# EAGLE design SWARM-OSMC (EAGLE 4.16)
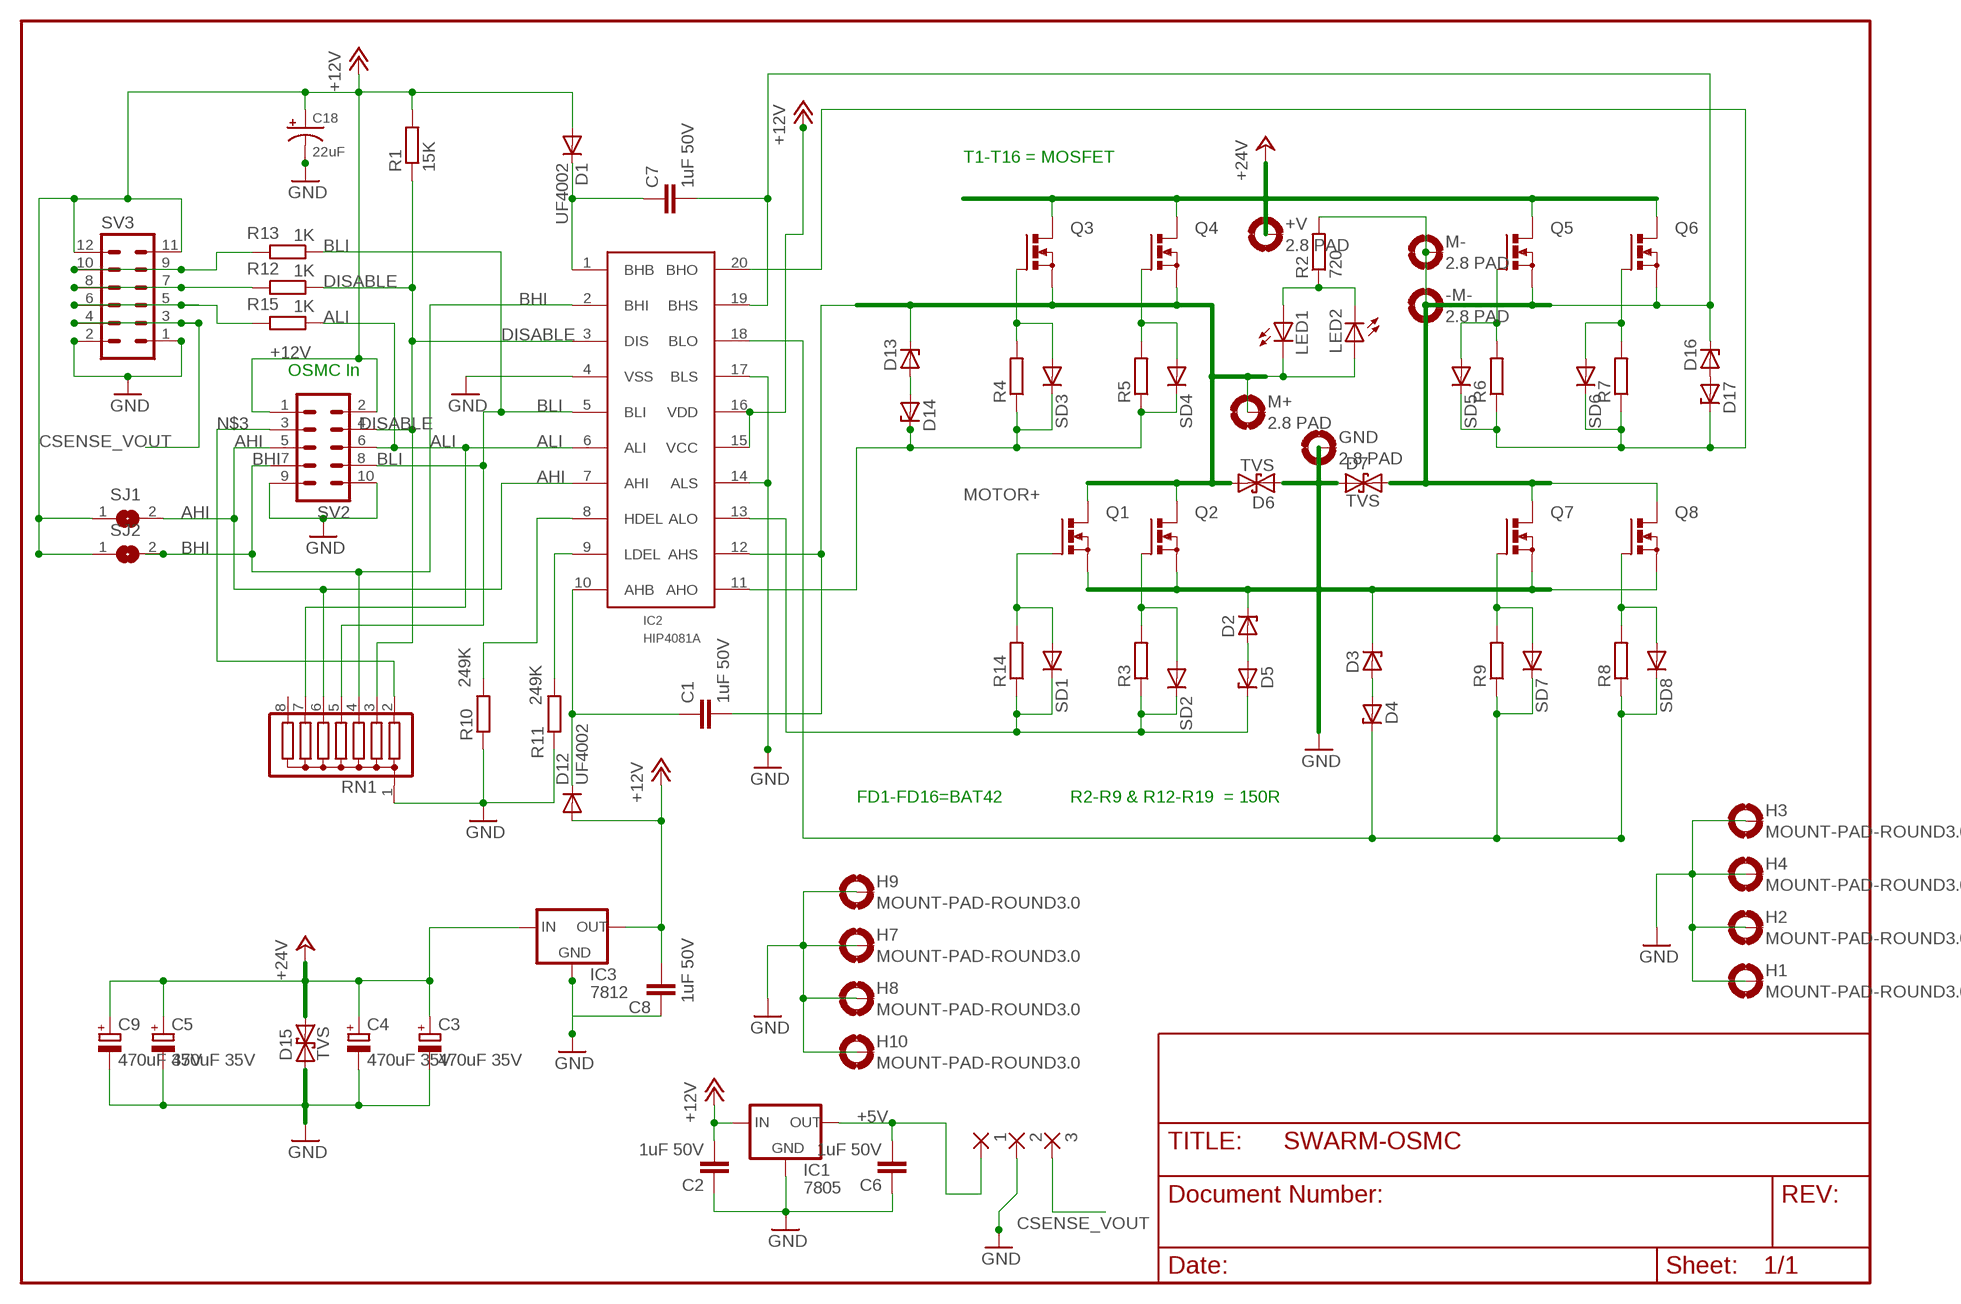
[diagram p0: schematic, sheet 1]

## Parts
1  1,6/0,8  [1,6/0,8]
2  1,6/0,8  [1,6/0,8]
3  1,6/0,8  [1,6/0,8]
+V  2.8 PAD  MOUNT-PAD-ROUND2.8  [2,8-PAD]
-M-  2.8 PAD  MOUNT-PAD-ROUND2.8  [2,8-PAD]
C1  1uF 50V  C-EUC1206  [C1206]
C2  1uF 50V  C-EUC1206  [C1206]
C3  470uF 35V  CPOL-EUE5-10.5  [E5-10,5@1]
C4  470uF 35V  CPOL-EUE5-10.5  [E5-10,5@1]
C5  470uF 35V  CPOL-EUE5-10.5  [E5-10,5@1]
C6  1uF 50V  C-EUC1206  [C1206]
C7  1uF 50V  C-EUC1206  [C1206]
C8  1uF 50V  C-EUC1206  [C1206]
C9  470uF 35V  CPOL-EUE5-10.5  [E5-10,5@1]
C18  22uF  CPOL-USCT7343  [CT7343]
D1  UF4002  DIODE-DO41-10  [DO41-10]
D2  ZENER-DIODESOD80C  [SOD80C]
D3  ZENER-DIODESOD80C  [SOD80C]
D4  ZENER-DIODESOD80C  [SOD80C]
D5  ZENER-DIODESOD80C  [SOD80C]
D6  TVS  P6KEXXC  [CB417-15]
D7  TVS  P6KEXXC  [CB417-15]
D12  UF4002  DIODE-DO41-10  [DO41-10]
D13  ZENER-DIODESOD80C  [SOD80C]
D14  ZENER-DIODESOD80C  [SOD80C]
D15  TVS  P6KEXXC  [CB417-15]
D16  ZENER-DIODESOD80C  [SOD80C]
D17  ZENER-DIODESOD80C  [SOD80C]
GND  2.8 PAD  MOUNT-PAD-ROUND2.8  [2,8-PAD]
H1  MOUNT-PAD-ROUND3.0  [3,0-PAD]
H2  MOUNT-PAD-ROUND3.0  [3,0-PAD]
H3  MOUNT-PAD-ROUND3.0  [3,0-PAD]
H4  MOUNT-PAD-ROUND3.0  [3,0-PAD]
H7  MOUNT-PAD-ROUND3.0  [3,0-PAD]
H8  MOUNT-PAD-ROUND3.0  [3,0-PAD]
H9  MOUNT-PAD-ROUND3.0  [3,0-PAD]
H10  MOUNT-PAD-ROUND3.0  [3,0-PAD]
IC1  7805  78XXS  [78XXS]
IC2  HIP4081A  [DIL20]
IC3  7812  78XXS  [78XXS]
LED1  LEDCHIPLED_1206  [CHIPLED_1206]
LED2  LEDCHIPLED_1206  [CHIPLED_1206]
M+  2.8 PAD  MOUNT-PAD-ROUND2.8  [2,8-PAD]
M-  2.8 PAD  MOUNT-PAD-ROUND2.8  [2,8-PAD]
Q1  PMOSFET_NTO220BV  [TO220BV]
Q2  PMOSFET_NTO220BV  [TO220BV]
Q3  PMOSFET_NTO220BV  [TO220BV]
Q4  PMOSFET_NTO220BV  [TO220BV]
Q5  PMOSFET_NTO220BV  [TO220BV]
Q6  PMOSFET_NTO220BV  [TO220BV]
Q7  PMOSFET_NTO220BV  [TO220BV]
Q8  PMOSFET_NTO220BV  [TO220BV]
R1  15K  R-EU_R1206  [R1206]
R2  720  R-EU_R1206  [R1206]
R3  R-EU_R1206  [R1206]
R4  R-EU_R1206  [R1206]
R5  R-EU_R1206  [R1206]
R6  R-EU_R1206  [R1206]
R7  R-EU_R1206  [R1206]
R8  R-EU_R1206  [R1206]
R9  R-EU_R1206  [R1206]
R10  249K  R-EU_R1206  [R1206]
R11  249K  R-EU_R1206  [R1206]
R12  1K  R-EU_R1206  [R1206]
R13  1K  R-EU_R1206  [R1206]
R14  R-EU_R1206  [R1206]
R15  1K  R-EU_R1206  [R1206]
RN1  G07R  [SIL8]
SD1  DIODE-SOD123  [SOD123]
SD2  DIODE-SOD123  [SOD123]
SD3  DIODE-SOD123  [SOD123]
SD4  DIODE-SOD123  [SOD123]
SD5  DIODE-SOD123  [SOD123]
SD6  DIODE-SOD123  [SOD123]
SD7  DIODE-SOD123  [SOD123]
SD8  DIODE-SOD123  [SOD123]
SJ1  SJ  [SJ]
SJ2  SJ  [SJ]
SV2  MA05-2  [MA05-2]
SV3  MA06-2  [MA06-2]

## Nets
+5V: 1.1(P) C6.2 IC1.OUT
+12V: C2.2 C8.2 C18.+ D1.A D12.A IC1.IN IC2.15(VCC) IC2.16(VDD) IC3.OUT R1.2 SJ1.1 SJ2.1 SV2.1 SV2.2 SV3.11 SV3.12
+24V: +V.B2,8(MOUNT) C3.+ C4.+ C5.+ C9.+ D15.C IC3.IN Q3.D Q4.D Q5.D Q6.D
AHI: IC2.7(AHI) RN1.6 SJ1.2 SV2.5
AHO: D14.C IC2.11(AHO) R4.1 R5.1 SD3.C SD4.C
ALI: IC2.6(ALI) R15.1 RN1.7 SV2.6
ALO: D5.C IC2.13(ALO) R3.1 R14.1 SD1.C SD2.C
BHI: IC2.2(BHI) RN1.4 SJ2.2 SV2.7
BHO: D17.C IC2.20(BHO) R6.1 R7.1 SD5.C SD6.C
BLI: IC2.5(BLI) R13.1 RN1.5 SV2.8
BLO: D4.C IC2.18(BLO) R8.1 R9.1 SD7.C SD8.C
CSENSE_VOUT: 3.1(P) SV3.3 SV3.4
DISABLE: IC2.3(DIS) R1.1 R12.1 RN1.3 SV2.4
GND: 2.1(P) C2.1 C3.- C4.- C5.- C6.1 C8.1 C9.- C18.- D2.C D3.C D6.A D7.A D15.A GND.B2,8(MOUNT) H1.B3,0(MOUNT) H2.B3,0(MOUNT) H3.B3,0(MOUNT) H4.B3,0(MOUNT) H7.B3,0(MOUNT) H8.B3,0(MOUNT) H9.B3,0(MOUNT) H10.B3,0(MOUNT) IC1.GND IC2.4(VSS) IC2.14(ALS) IC2.17(BLS) IC3.GND Q1.S Q2.S Q7.S Q8.S R10.1 R11.1 RN1.1 SV2.9 SV2.10 SV3.1 SV3.2
MOTOR+: C1.2 D6.C D13.C IC2.12(AHS) LED1.C LED2.A M+.B2,8(MOUNT) Q1.D Q2.D Q3.S Q4.S
MOTOR-: -M-.B2,8(MOUNT) C7.2 D7.C D16.C IC2.19(BHS) M-.B2,8(MOUNT) Q5.S Q6.S Q7.D Q8.D R2.2
N$1: C1.1 D12.C IC2.10(AHB)
N$2: C7.1 D1.C IC2.1(BHB)
N$3: RN1.2 SV2.3
N$5: LED1.A LED2.C R2.1
N$6: IC2.8(HDEL) R10.2
N$7: IC2.9(LDEL) R11.2
N$8: Q5.G R6.2 SD5.A
N$12: Q2.G R3.2 SD2.A
N$13: R13.2 SV3.9 SV3.10
N$14: Q3.G R4.2 SD3.A
N$15: R12.2 SV3.7 SV3.8
N$16: Q1.G R14.2 SD1.A
N$17: Q7.G R9.2 SD7.A
N$18: R15.2 SV3.5 SV3.6
N$21: Q8.G R8.2 SD8.A
N$23: D13.A D14.A
N$31: D16.A D17.A
N$32: Q6.G R7.2 SD6.A
N$41: D2.A D5.A
N$44: D3.A D4.A
SD4: Q4.G R5.2 SD4.A
Unconnected: RN1.8

## Notes on the sheet
- T1-T16 = MOSFET
- OSMC In
- FD1-FD16=BAT42 | R2-R9 & R12-R19  = 150R

## Library data of the parts
1-3 = wirepad:1,6/0,8: THROUGH-HOLE PAD
+V -M- GND H1-H4 H7-H10 M+ M- = holes:MOUNT-PAD-ROUND: MOUNTING PAD, round
C1 C2 C6-C8 = rcl:C-EU: CAPACITOR, European symbol
C3-C5 C9 = rcl:CPOL-EU: POLARIZED CAPACITOR, European symbol
C18 = rcl:CPOL-US: POLARIZED CAPACITOR, American symbol
D1 D12 SD1-SD8 = diode:DIODE-: DIODE
D2-D5 D13 D14 D16 D17 = diode:ZENER-DIODE: Z-Diode
D6 D7 D15 = diode:P6KEXXC: DIODE transient-voltage suppressor
IC1 IC3 = v-reg:78XXS: VOLTAGE REGULATOR
IC2 = My linear:HIP4081A: Full Bridge FET driver
LED1 LED2 = led:LED: LED OSRAM: - CHIPLED LG R971, LG N971, LY N971, LG Q971, LY Q971, LO R971, LY R971 LH N974, LH R974 LS Q976, LO Q976, LY Q976 LO Q996 - Hyper CHIPLED LW Q18S LB Q993, LB Q99A, LB R99A - SideLED LS A670, LO A670, LY A670, LG A670, LP A670 LB A673, LV A673, LT A673, LW A673 LH A674 LY A675 LS A676, LA A676, LO A676, LY A676, LW A676 LS A679, LY A679, LG A679 - Hyper Micro SIDELED® LS Y876, LA Y876, LO Y876, LY Y876 LT Y87S - SmartLED LW L88C, LW L88S LB L89C, LB L89S, LG L890 LS L89K, LO L89K, LY L89K LS L896, LA L896, LO L896, LY L896 - TOPLED LS T670, LO T670, LY T670, LG T670, LP T670 LSG T670, LSP T670, LSY T670, LOP T670, LYG T670 LG T671, LOG T671, LSG T671 LB T673, LV T673, LT T673, LW T673 LH T674 LS T676, LA T676, LO T676, LY T676, LB T676, LH T676, LSB T676, LW T676 LB T67C, LV T67C, LT T67C, LS T67K, LO T67K, LY T67K, LW E67C LS E67B, LA E67B, LO E67B, LY E67B, LB E67C, LV E67C, LT E67C LW T67C LS T679, LY T679, LG T679 LS T770, LO T770, LY T770, LG T770, LP T770 LB T773, LV T773, LT T773, LW T773 LH T774 LS E675, LA E675, LY E675, LS T675 LS T776, LA T776, LO T776, LY T776, LB T776 LHGB T686 LT T68C, LB T68C - Hyper Mini TOPLED® LB M676 - Mini TOPLED Santana® LG M470 LS M47K, LO M47K, LY M47K Source: http://www.osram.convergy.de - LUMILED® LXK2-PW12-R00, LXK2-PW12-S00, LXK2-PW14-U00, LXK2-PW14-V00 LXK2-PM12-R00, LXK2-PM12-S00, LXK2-PM14-U00 LXK2-PE12-Q00, LXK2-PE12-R00, LXK2-PE12-S00, LXK2-PE14-T00, LXK2-PE14-U00 LXK2-PB12-K00, LXK2-PB12-L00, LXK2-PB12-M00, LXK2-PB14-N00, LXK2-PB14-P00, LXK2-PB14-Q00 LXK2-PR12-L00, LXK2-PR12-M00, LXK2-PR14-Q00, LXK2-PR14-R00 LXK2-PD12-Q00, LXK2-PD12-R00, LXK2-PD12-S00 LXK2-PH12-R00, LXK2-PH12-S00 LXK2-PL12-P00, LXK2-PL12-Q00, LXK2-PL12-R00 Source: www.luxeon.com
Q1-Q8 = transistor-power:PMOSFET_N: Power MOSFET N-Channel
R1-R15 = rcl:R-EU_: RESISTOR, European symbol
RN1 = resistor-sil:G07R: SIL RESISTOR
SJ1 SJ2 = jumper:SJ: SMD solder JUMPER
SV2 = con-lstb:MA05-2: PIN HEADER
SV3 = con-lstb:MA06-2: PIN HEADER

## Board
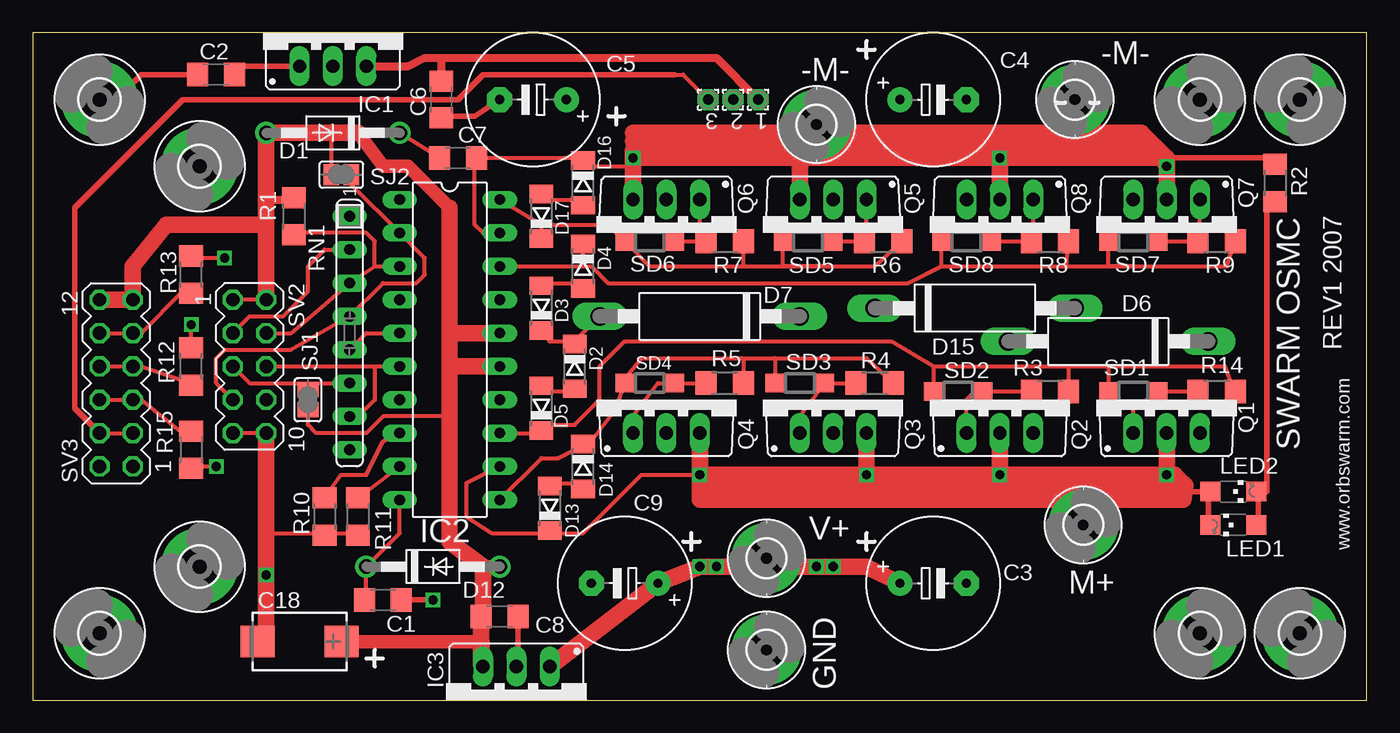
[diagram p1: board, top side]
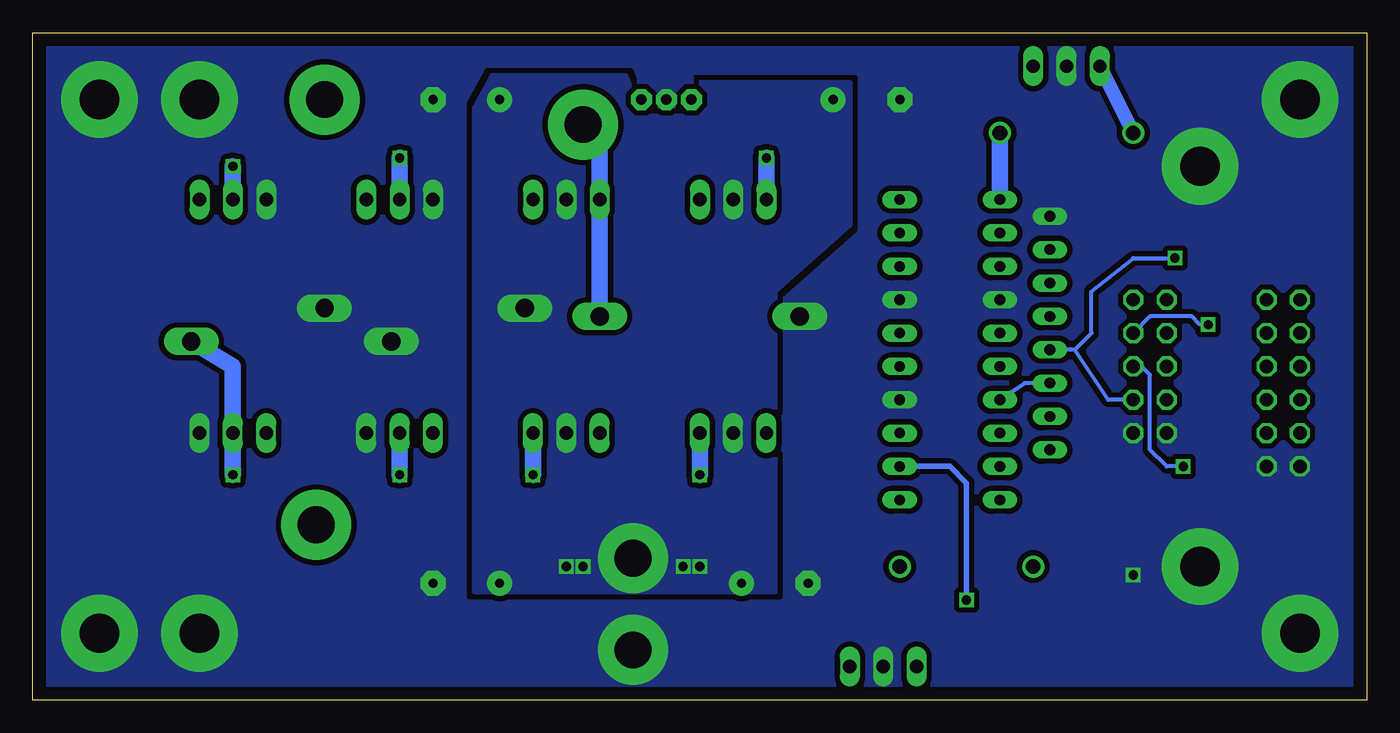
[diagram p2: board, bottom side, seen from below]

Size 101.6 x 50.8 mm. Coordinates in mm from the lower left corner, seen from the top.
Outline: 0,0 101.6,0 101.6,50.8 0,50.8 0,0
Copper layers (1*16): Top 0.035mm / dielectric 1.5mm / Bottom 0.035mm
Design rules "default": minimum track width 10mil, minimum drill 24mil, track to track 8mil, track to pad 8mil, pad to pad 8mil, via to via 8mil, smd to smd 8mil, copper to edge 40mil, drill to drill 8mil, minimum pad ring 10mil, minimum via ring 8mil, stop-mask expansion 4mil, vias tented up to drill 0mil, thermal gap 10mil

### Footprints (pad centres in the part's own frame; a part is rotated, then mirrored left to right if it is on the bottom)
1,6/0,8 = drill 0.813 pad 1.6 octagon: 1 0,0
2,8-PAD = drill 2.8 pad 5.334 round: B2,8 0,0
C1206 = smd 1.6 x 1.8: 1 -1.4,0; 2 1.4,0
E5-10,5@1 = drill 0.7 pad 1.9 round: + -2.54,0 | drill 0.7 pad 1.9 octagon: - 2.54,0
CT7343 = smd 2.6 x 2.4: + 3.2,0; - -3.2,0
DO41-10 = drill 1.118 round: A 5.08,0; C -5.08,0
SOD80C = smd 1.4 x 1.8: A 1.7,0; C -1.7,0
CB417-15 = drill 1.397 long: A 7.62,0; C -7.62,0
3,0-PAD = drill 3 pad 5.842 round: B3,0 0,0
78XXS = drill 1.016 long: GND 0,-2.54; IN -2.54,-2.54; OUT 2.54,-2.54
DIL20 = drill 0.813 long: 1 -11.43,-3.81; 2 -8.89,-3.81; 3 -6.35,-3.81; 4 -3.81,-3.81; 5 -1.27,-3.81; 6 1.27,-3.81; 7 3.81,-3.81; 8 6.35,-3.81; 9 8.89,-3.81; 10 11.43,-3.81; 11 11.43,3.81; 12 8.89,3.81; 13 6.35,3.81; 14 3.81,3.81; 15 1.27,3.81; 16 -1.27,3.81; 17 -3.81,3.81; 18 -6.35,3.81; 19 -8.89,3.81; 20 -11.43,3.81
CHIPLED_1206 = smd 1.5 x 1.5: A 0,-1.75; C 0,1.75
TO220BV = drill 1.016 long: D 0,-2.54; G -2.54,-2.54; S 2.54,-2.54
R1206 = smd 1.6 x 1.803: 1 -1.422,0; 2 1.422,0
SIL8 = drill 0.813 long: 1 -8.89,0; 2 -6.35,0; 3 -3.81,0; 4 -1.27,0; 5 1.27,0; 6 3.81,0; 7 6.35,0; 8 8.89,0
SOD123 = smd 1.4 x 1.4: A 1.9,0; C -1.9,0
SJ = smd 1.168 x 1.6: 1 -0.762,0; 2 0.762,0
MA05-2 = drill 1.016 octagon: 1 -5.08,-1.27; 2 -5.08,1.27; 3 -2.54,-1.27; 4 -2.54,1.27; 5 0,-1.27; 6 0,1.27; 7 2.54,-1.27; 8 2.54,1.27; 9 5.08,-1.27; 10 5.08,1.27
MA06-2 = drill 1.016 octagon: 1 -6.35,-1.27; 2 -6.35,1.27; 3 -3.81,-1.27; 4 -3.81,1.27; 5 -1.27,-1.27; 6 -1.27,1.27; 7 1.27,-1.27; 8 1.27,1.27; 9 3.81,-1.27; 10 3.81,1.27; 11 6.35,-1.27; 12 6.35,1.27

### Placement (x,y rotation side)
1  55.24,45.72 180 top
2  53.34,45.72 180 top
3  51.44,45.72 180 top
+V  55.88,10.79 0 top
-M-  79.38,45.72 0 top
C1  26.67,7.62 0 top
C2  13.97,47.62 0 top
C3  68.58,8.89 0 top
C4  68.58,45.72 0 top
C5  38.1,45.72 180 top
C6  31.11,45.72 90 top
C7  32.38,41.27 0 top
C8  35.56,6.35 180 top
C9  45.09,8.89 180 top
C18  20.32,4.45 0 top
D1  22.86,43.18 180 top
D2  41.27,25.4 270 top
D3  38.73,29.84 90 top
D4  41.91,33.02 270 top
D5  38.73,22.23 90 top
D6  81.92,27.3 180 top
D7  50.8,29.21 180 top
D12  30.48,10.16 0 top
D13  39.37,14.61 90 top
D14  41.91,17.78 270 top
D15  71.75,29.84 0 top
D16  41.91,39.37 270 top
D17  38.73,36.83 90 top
GND  55.88,3.81 0 top
H1  12.7,10.16 0 top
H2  12.7,40.64 0 top
H3  88.9,5.08 0 top
H4  88.9,45.72 0 top
H7  5.08,45.72 90 top
H8  96.52,45.72 90 top
H9  96.52,5.08 90 top
H10  5.08,5.08 90 top
IC1  22.86,50.8 0 top
IC2  31.75,26.67 270 top
IC3  36.83,0 180 top
LED1  91.44,13.34 90 top
LED2  91.44,15.88 270 top
M+  80.01,13.34 0 top
M-  59.69,43.81 0 top
Q1  86.36,22.86 0 top
Q2  73.66,22.86 0 top
Q3  60.96,22.86 0 top
Q4  48.26,22.86 0 top
Q5  60.96,35.56 180 top
Q6  48.26,35.56 180 top
Q7  86.36,35.56 180 top
Q8  73.66,35.56 180 top
R1  19.88,36.83 90 top
R2  94.61,39.37 90 top
R3  77.47,23.5 180 top
R4  64.14,24.13 180 top
R5  52.7,24.13 180 top
R6  64.77,34.92 180 top
R7  52.7,34.92 180 top
R8  77.47,34.92 180 top
R9  90.17,34.92 180 top
R10  22.23,13.97 90 top
R11  24.77,13.97 90 top
R12  12.06,25.4 270 top
R13  12.06,32.38 270 top
R14  90.17,23.5 180 top
R15  12.06,19.05 90 top
RN1  24.13,27.94 270 top
SD1  83.82,23.5 0 top
SD2  70.48,23.5 0 top
SD3  58.42,24.13 0 top
SD4  46.99,24.13 0 top
SD5  59.05,34.92 0 top
SD6  46.99,34.92 0 top
SD7  83.82,34.92 0 top
SD8  71.12,34.92 0 top
SJ1  20.95,22.86 90 top
SJ2  23.5,40.01 0 top
SV2  16.51,25.4 270 top
SV3  6.35,24.13 90 top

### Tracks (layer width: path | path; a pad name or v marks a point on that pad's centre or on a via)
+5V
  Top 0.61: 31.11,48.9 29.84,48.9 28.57,48.26 IC1.OUT | 31.11,48.9 52.07,48.9 1.1 | 31.11,48.9 C6.2
+12V
  Top 0.305: SV2.2 SV2.1 | SJ1.1 20.95,20.95 21.59,20.32 25.4,20.32 26.67,21.59 31.75,21.59 | SJ2.1 22.73,43.69 22.86,43.18
  Top 0.406: C2.2 15.88,47.62 15.88,48.26 IC1.IN
  Top 0.61: 17.78,38.1 19.68,38.1 R1.2
  Top 1.016: 31.75,37.47 28.57,40.64 26.67,40.64 24.77,43.18 | C8.2 34.29,6.35 | 34.16,2.67 IC3.OUT 34.29,4.45 C18.+ | 34.29,10.16 D12.A
  Top 1.27: 31.75,25.4 31.75,27.94 | 31.75,27.94 IC2.16 | 31.75,25.4 IC2.15 | 17.78,36.2 SV2.2 | 31.75,27.94 31.75,37.47 | 24.77,43.18 22.86,43.18 D1.A 17.78,38.1 17.78,36.2 | SV3.12 SV3.11 7.62,33.02 10.16,36.2 17.78,36.2 | 34.29,6.35 34.29,10.16 31.75,12.06 31.75,21.59 31.75,25.4 | 34.16,2.67 C8.2
  Bottom 1.016: D1.A IC1.IN
+24V  (via drill 0.7)
  Top 1.27: IC3.IN C9.+ v50.8,10.16 v52.07,10.16 55.88,10.16 | 55.88,10.16 +V.B2,8 | 55.88,10.16 v59.69,10.16 v60.96,10.16 63.5,10.16 C3.+
  pour Bottom (isolate 0.406, no thermals): 45.09,8.26 58.42,8.26 58.1,8.26 67.94,8.26 67.94,45.09 66.62,47.52 56.46,47.52 55.24,44.45 51.44,44.45 50.8,46.99 39.37,46.99 39.37,36.2 45.09,31.11
AHI
  Top 0.305: 20.95,24.13 16.51,24.13 SV2.5 | 20.95,24.13 RN1.6 | 20.95,24.13 SJ1.2
  Bottom 0.305: IC2.7 26.04,24.13 RN1.6
AHO
  Top 0.305: 53.98,26.04 46.35,26.04 45.09,24.44 SD4.C 44.45,22.23 42.55,19.68 41.91,19.68 | R5.1 54.13,25.88 53.98,26.04 | 56.52,26.04 63.5,26.04 R4.1 | 53.98,26.04 56.52,26.04 | 56.52,26.04 SD3.C | 42.34,19.48 D14.C 41.91,19.68 | 42.34,19.48 41.27,19.05 40.01,18.41 38.73,18.41 IC2.11 | 42.34,19.48 41.91,19.68
ALI  (via drill 0.7)
  Top 0.305: 26.04,25.4 IC2.6 | RN1.7 24.77,21.59 26.04,22.86 26.04,25.4 | SV2.6 26.04,25.4 | v13.97,17.78 12.06,17.78 R15.1 12.06,17.14
  Bottom 0.305: 17.14,25.4 16.51,24.77 16.51,19.05 15.24,17.78 v13.97,17.78
  Bottom 0.406: 17.14,25.4 SV2.6
ALO
  Top 0.305: 68.58,25.39 70.48,25.4 78.89,25.4 | 78.89,25.4 81.92,25.4 | 78.89,25.4 R3.1 | SD1.C 81.92,25.4 | 81.92,25.4 90.81,25.4 91.5,23.33 91.44,23.5 R14.1 | 68.58,25.39 SD2.C | 68.58,25.39 65.41,27.3 45.09,27.3 43.18,25.4 43.18,22.86 41.27,20.95 38.1,20.95 | IC2.13 38.1,20.32 38.1,20.95 | 38.1,20.95 D5.C
BHI
  Top 0.305: SV2.7 13.97,24.13 13.97,26.04 14.61,26.67 19.68,26.67 RN1.4 26.67,31.75 29.21,31.75 29.84,32.38 29.84,33.66 IC2.2 24.26,39.24 SJ2.2
BHO
  Top 0.305: 54.13,33.02 R7.1 | R6.1 64.14,33.02 60.33,33.02 | 54.13,33.02 60.33,33.02 | SD5.C 57.16,33.02 60.33,33.02 | SD6.C 46.99,33.02 54.13,33.02 | 38.73,36.2 43.81,36.2 SD6.C | SD6.C | D17.C 38.73,36.2 | 38.73,36.2 IC2.20
BLI  (via drill 0.7)
  Top 0.305: IC2.5 25.4,27.94 RN1.5 | v14.61,33.66 12.06,33.66 R13.1
  Bottom 0.305: 22.23,26.67 19.68,22.86 SV2.8 | 22.23,26.67 RN1.5 | 22.23,26.67 20.95,27.94 20.95,31.11 17.78,33.66 v14.61,33.66
BLO
  Top 0.305: R9.1 90.96,33.02 83.82,33.02 | SD7.C 81.92,33.02 83.82,33.02 | 78.74,33.02 R8.1 | 78.74,33.02 83.82,33.02 | SD8.C 69.22,33.02 | 69.22,33.02 78.74,33.02 | 69.22,33.02 66.67,31.75 43.81,31.75 42.55,33.02 41.91,33.02 | 41.91,33.02 D4.C | IC2.18 41.91,33.02
CSENSE_VOUT
  Top 0.305: SV3.4 SV3.3 | 48.9,47.62 49.53,47.62 3.1
  Top 0.406: SV3.4 3.17,22.23 3.17,37.47 11.43,45.72 32.38,45.72 34.29,47.62 48.9,47.62
DISABLE  (via drill 0.7)
  Top 0.305: 26.04,33.02 IC2.3 | 26.04,33.02 RN1.3 19.68,27.94 SV2.4 | R1.1 20.17,35.41 20.32,35.56 25.4,35.56 26.04,34.92 26.04,33.02 | R12.1 v12.06,28.57 R12.1 | R12.1 12.06,26.67
  Bottom 0.305: SV2.4 16.51,29.21 13.34,29.21 12.7,28.57 v12.06,28.57
GND  (via drill 0.7)
  Top 0.305: 41.27,27.3 39.37,27.3 D3.C | 41.27,27.3 D2.C | 41.27,27.3 D7.A | 24.77,12.7 22.23,12.7 17.78,12.7 SV2.10 17.75,20.32 | 17.75,20.32 17.14,20.32 | 17.14,20.32 SV2.9 | 17.75,20.32 17.12,20.3 17.14,20.32
  Top 0.406: C8.1 36.96,2.67 IC3.GND | H7.B3,0 6.35,45.72 8.26,47.62 C2.1 12.7,47.62 | C6.1 31.75,44.45 33.66,44.45 C5.-
  Top 1.27: 24.77,12.7 R11.1 | 22.23,12.7 R10.1 | C18.- 17.78,5.08 v17.78,9.53 17.75,20.32
  pour Bottom (isolate 0.406, rank 2, no thermals): 100.97,0.64 100.97,50.16 0.64,50.16 0.64,0.64
MOTOR+  (via drill 0.7)
  Top 0.305: v50.8,17.14 46.35,17.14 41.91,12.7 38.73,12.7 D13.C 38.53,12.7 34.92,12.7 33.02,13.97 33.02,16.51 IC2.12 | 81.43,15.09 87.63,15.24 87,15.88 86.36,16.51 | v86.36,17.14 85.09,15.88
  Top 0.406: Q1.D v86.36,17.14 80.64,17.14 | C1.2 v30.48,7.62 | C1.2 28.57,7.62 | C1.2 27.94,7.62 | LED1.C 89.53,13.34 89.53,15.88 | 87,15.88 89.53,15.88 | 89.53,15.88 LED2.A | 80.01,15.24 M+.B2,8
  Top 1.27: v63.5,17.14 Q3.S | v50.8,17.14 v63.5,17.14 | v73.66,17.14 v86.36,17.14 Q1.D | v63.5,17.14 v73.66,17.14 | v50.8,17.14 50.8,18.41 | 50.8,18.41 Q4.S | v73.66,17.14 Q2.D | v50.8,17.14 v63.5,17.14 | 50.8,18.41 50.8,16.51 | 50.8,16.51 50.8,15.24 80.01,15.24 87.63,15.24 87.78,16.36 87,17.14 | 50.8,16.51 86.36,16.51 87.63,16.51
  Bottom 0.406: IC2.12 31.75,17.78 30.48,16.51 v30.48,7.62
  Bottom 1.27: v63.5,17.14 Q3.S | v50.8,17.14 Q4.S | v73.66,17.14 Q2.D | v86.36,17.14 86.36,25.4 D6.C
MOTOR-  (via drill 0.7)
  Top 0.305: 41.91,40.64 41.91,41.27 C7.2 | 41.91,40.64 45.72,40.64 | 33.66,41.27 33.66,36.2 34.29,35.56 IC2.19 | 41.91,40.64 D16.C | 58.42,41.27 58.42,41.91 59.69,41.91
  Top 0.406: v86.36,40.64 86.51,40.79 | 86.11,41.15 86.36,41.27 94.61,41.27 R2.2
  Top 1.27: v73.66,41.27 Q8.D | v45.72,41.27 58.42,41.27 | 58.42,41.27 v73.66,41.27 | v73.66,41.27 86.36,41.27 | 86.36,41.27 v86.36,40.64 | v86.36,40.64 Q7.D | Q6.S 45.72,40.64 v45.72,41.27 | 58.42,41.27 Q5.S | v45.72,41.27 45.72,41.91 | 33.66,41.27 C7.2 | v86.36,40.64 86.11,41.15 85.72,41.91 85.09,41.91 | 79.38,43.18 45.72,43.18 | 84.45,42.55 45.72,42.55 | 84.45,43.18 79.38,43.18 | 79.38,43.18 -M-.B2,8 | 59.69,41.91 M-.B2,8 | 86.36,41.27 84.45,42.55 | 84.45,42.55 85.09,42.55 84.45,43.18 | 86.36,41.27 84.45,43.18
  Bottom 1.27: v73.66,41.27 Q8.D | v86.36,40.64 Q7.D | Q6.S v45.72,41.27 | 58.42,42.55 Q5.S D7.C
N$1
  Top 0.305: IC2.10 27.94,12.7 D12.C 25.4,7.62
  Top 1.016: C1.1 25.4,7.62
N$2
  Top 0.305: D1.C C7.1
  Bottom 1.27: IC2.1 D1.C
N$3
  Top 0.305: RN1.2 22.23,34.29 20.95,33.02 20.95,31.11 19.05,29.21 16.51,29.21 SV2.3
N$5
  Top 0.406: LED1.A 93.34,13.34 93.34,15.88 LED2.C 93.98,15.88 93.98,37.47 94.61,37.47 R2.1
N$6
  Top 0.305: IC2.8 26.67,19.68 25.4,17.14 23.5,17.14 R10.2
N$7
  Top 0.305: 25.4,15.24 R11.2 25.4,15.88 IC2.9
N$8
  Top 0.305: 63.5,34.92 Q5.G | SD5.A R6.2
  Top 1.27: R6.2 63.5,34.92
N$12
  Top 0.305: Q2.G 71.12,22.86 71.75,23.5 SD2.A R3.2
N$13
  Top 0.305: R13.2 12.06,31.11 11.43,31.11 8.26,27.94 | SV3.10 SV3.9
  Top 0.406: SV3.9 8.26,27.94
N$14
  Top 0.305: Q3.G 58.42,21.59 SD3.A R4.2 62.87,24.13
N$15
  Top 0.305: 8.26,25.4 12.06,24.13 R12.2 | SV3.8 SV3.7
  Top 0.406: SV3.7 8.26,25.4
N$16
  Top 0.305: Q1.G 83.82,22.23 SD1.A R14.2 88.27,23.5
N$17
  Top 0.305: Q7.G 88.9,34.29 R9.2 SD7.A
N$18
  Top 0.305: R15.2 12.06,20.32 11.43,20.32 8.26,22.86 | SV3.6 SV3.5
  Top 0.406: SV3.5 8.26,22.86
N$21
  Top 0.305: Q8.G 76.2,35.56 75.56,35.56 75.56,34.29 R8.2 SD8.A
N$23
  Top 0.305: D14.A 41.91,16.51 39.37,16.51 D13.A 39.37,15.88
N$31
  Top 0.305: D17.A 38.73,38.1 41.48,38.1 D16.A
N$32
  Top 0.305: Q6.G 50.8,34.29 R7.2 SD6.A
N$41
  Top 0.305: 38.1,24.13 D5.A 38.73,23.5 40.64,23.5 D2.A
N$44
  Top 0.305: D3.A 38.73,31.75 41.07,31.75 D4.A
SD4
  Top 0.305: Q4.G 45.72,21.59 47.62,24.13 | 50.8,24.13 R5.2 47.62,24.13 | 47.62,24.13 SD4.A

### Text on the board
tPlace: -M- | -M- | REV1 2007 | SWARM OSMC | V+ | www.orbswarm.com | M+ | GND